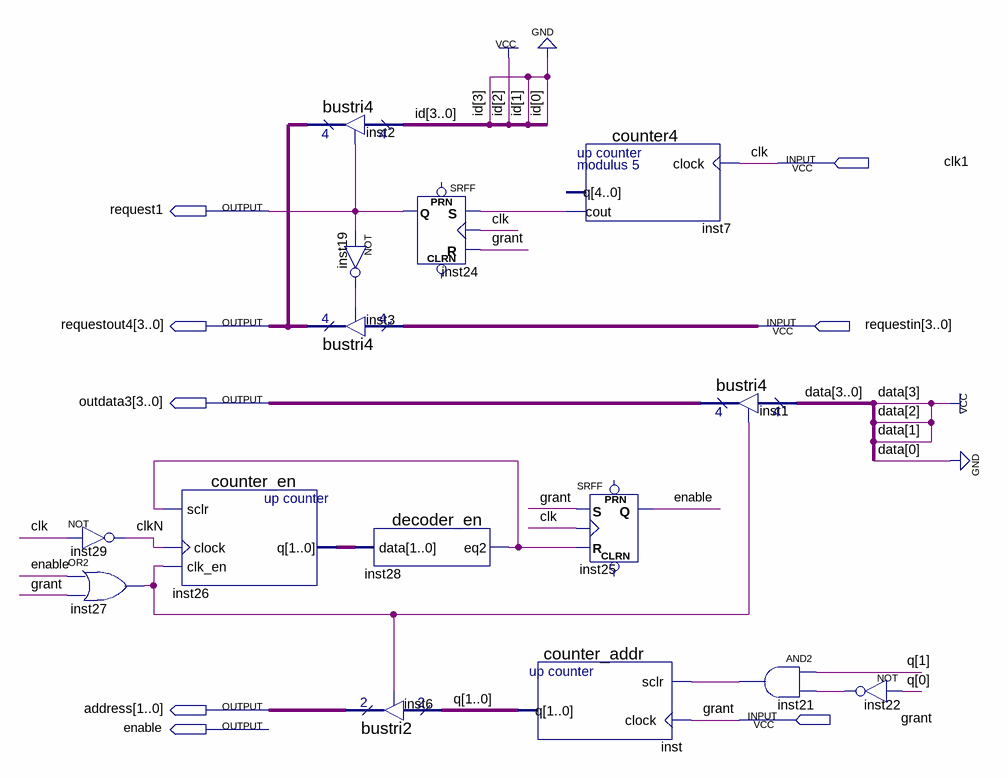
[diagram p0: schematic sheet]
// Quartus schematic master4.bdf as structural Verilog: 15 symbols, 8 pins
module master4 (
  input  clk1,
  input  [3:0] requestin,
  input  grant,
  output request1,
  output [3:0] requestout4,
  output [3:0] outdata3,
  output [1:0] address,
  output enable
);

  wire clkN, inst7_cout, inst19_out, inst21_out, inst22_out, inst27_out, inst28_eq2;
  wire [1:0] inst26_q, q;

  not inst29 (clkN, clk1);
  or inst27 (inst27_out, enable, grant);
  counter_en inst26 (.sclr(inst28_eq2), .clock(clkN), .clk_en(inst27_out), .q(inst26_q));
  bustri4 inst2 (.enabledt(request1), .data(4'b0100), .tridata(requestout4));
  bustri4 inst3 (.enabledt(inst19_out), .data(requestin), .tridata(requestout4));
  not inst19 (inst19_out, request1);
  decoder_en inst28 (.data(inst26_q), .eq2(inst28_eq2));
  bustri2 inst6 (.enabledt(inst27_out), .data(q), .tridata(address));
  SRFF inst24 (.S(inst7_cout), .R(grant), .CLK(clk1), .Q(request1));  // open: PRN, CLRN
  counter_addr inst (.sclr(inst21_out), .clock(grant), .q(q));
  counter4 inst7 (.clock(clk1), .cout(inst7_cout));  // open: q
  SRFF inst25 (.S(grant), .R(inst28_eq2), .CLK(clk1), .Q(enable));  // open: PRN, CLRN
  bustri4 inst1 (.enabledt(inst27_out), .data(4'b1110), .tridata(outdata3));
  and inst21 (inst21_out, q[1], inst22_out);
  not inst22 (inst22_out, q[0]);

  // Other names for the same wires on the sheet: clk = clk1
endmodule
